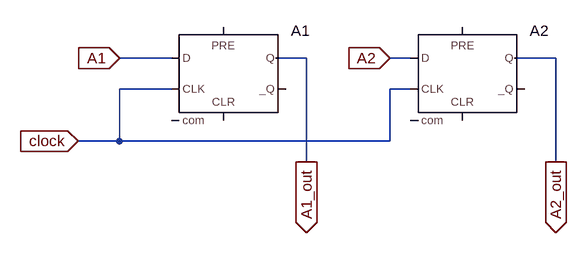
[diagram p0: schematic dflipflop_2bit.asc]
dflipflop_2bit.asc, the LTspice schematic file:
Version 4
SHEET 1 880 680
WIRE 16 176 -64 176
WIRE 224 176 176 176
WIRE 384 176 352 176
WIRE 608 176 544 176
WIRE 16 224 -64 224
WIRE 384 224 352 224
WIRE -64 304 -64 224
WIRE -64 304 -128 304
WIRE 352 304 352 224
WIRE 352 304 -64 304
WIRE 224 336 224 176
WIRE 608 336 608 176
FLAG -64 176 A1
IOPIN -64 176 In
FLAG 352 176 A2
IOPIN 352 176 In
FLAG -128 304 clock
IOPIN -128 304 In
FLAG 224 336 A1_out
IOPIN 224 336 Out
FLAG 608 336 A2_out
IOPIN 608 336 Out
SYMBOL Digital\\dflop 96 128 R0
SYMATTR InstName A1
SYMBOL Digital\\dflop 464 128 R0
SYMATTR InstName A2

The netlist it stands for:
* dflipflop_2bit.asc
A1 A1 0 clock 0 0 0 A1_out 0 DFLOP
A2 A2 0 clock 0 0 0 A2_out 0 DFLOP
.backanno
.end